# EAGLE design Blinker (EAGLE 6.3)
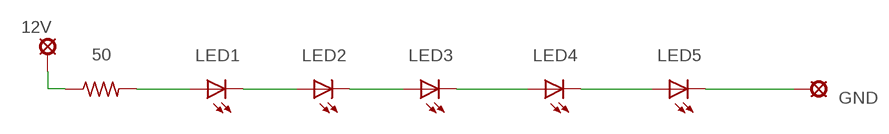
[diagram p0: schematic, sheet 1]

## Parts
12V  LSP13  [LSP13]
50  RESISTORSMD1206  [R1206]
GND  LSP13  [LSP13]
LED1  LED1  LED-2AC-CP41B-WES  [CP41B]
LED2  LED2  LED-2AC-CP41B-WES  [CP41B]
LED3  LED3  LED-2AC-CP41B-WES  [CP41B]
LED4  LED4  LED-2AC-CP41B-WES  [CP41B]
LED5  LED5  LED-2AC-CP41B-WES  [CP41B]

## Nets
GND: GND.MP LED5.1(C) LED5.4(C)
N$1: 50.2 LED1.2(A) LED1.3(A)
N$2: LED1.1(C) LED1.4(C) LED2.2(A) LED2.3(A)
N$3: LED2.1(C) LED2.4(C) LED3.2(A) LED3.3(A)
N$4: LED3.1(C) LED3.4(C) LED4.2(A) LED4.3(A)
N$5: LED4.1(C) LED4.4(C) LED5.2(A) LED5.3(A)
N$9: 12V.MP 50.1

## Library data of the parts
12V GND = solpad:LSP13: SOLDER PAD drill 1.3 mm, distributor Buerklin, 12H562
50 = SolarJackets_Common:RESISTOR
LED1-LED5 = led:LED-2AC-: LEDs with 2 Cathode & 2 Anode - Kingbright SUPER FLUX LED LAMP Source: www.us.kingbright.com/images/catalog/SPEC/W7676CPBC-H.pdf Cree® P4 LED CP41B-WES/WGS Source: Data sheet <http://www.cree.com/products/pdf/LEDlamps/CP41B-WES&WGS.pdf>

## Board
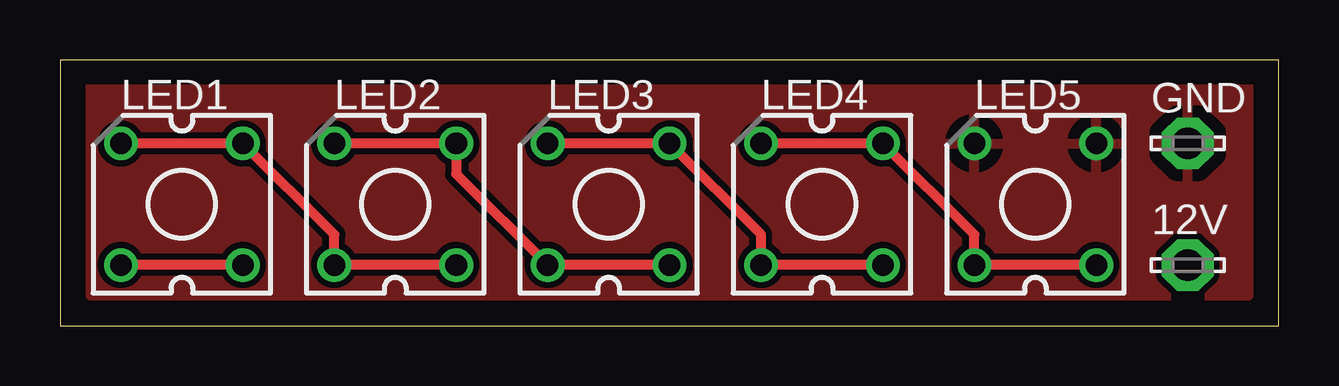
[diagram p1: board, top side]
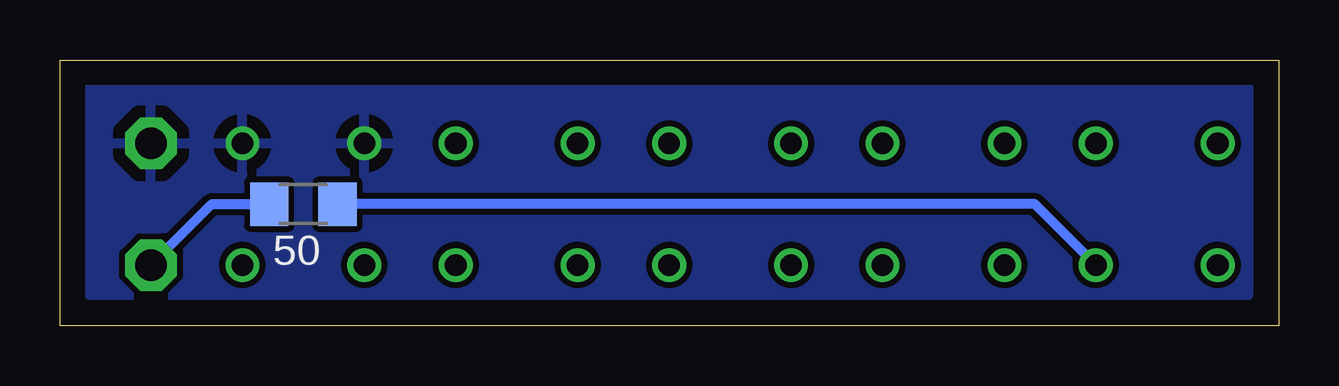
[diagram p2: board, bottom side, seen from below]

Size 50.78 x 11.1 mm. Coordinates in mm from the lower left corner, seen from the top.
Outline: 0,0 50.78,0 50.78,11.1 0,11.1 0,0
Copper layers (1*16): Top 0.035mm / dielectric 1.5mm / Bottom 0.035mm
Design rules "SJ Design Rules": minimum track width 16mil, minimum drill 24mil, track to track 10mil, track to pad 10mil, pad to pad 10mil, via to via 10mil, smd to smd 10mil, copper to edge 40mil, drill to drill 10mil, minimum pad ring 10mil, minimum via ring 8mil, stop-mask expansion 4mil, vias tented up to drill 0mil, thermal gap 20mil

### Footprints (pad centres in the part's own frame; a part is rotated, then mirrored left to right if it is on the bottom)
LSP13 = drill 1.321 pad 2.159 octagon: MP 0,0
R1206 = smd 1.6 x 1.803: 1 -1.422,0; 2 1.422,0
CP41B = drill 0.9 pad 1.27: 1 -2.54,2.54; 2 -2.54,-2.54; 3 2.54,-2.54; 4 2.54,2.54

### Placement (x,y rotation side)
12V  46.99,2.54 0 top
50  40.64,5.08 0 bottom
GND  46.99,7.62 0 top
LED1  5.08,5.08 0 top
LED2  13.97,5.08 0 top
LED3  22.86,5.08 0 top
LED4  31.75,5.08 0 top
LED5  40.64,5.08 0 top

### Tracks (layer width: path | path; a pad name or v marks a point on that pad's centre or on a via)
GND
  pour Bottom: 1.27,10.16 1.27,1.27 49.53,1.27 49.53,10.16
  pour Top: 1.27,10.16 1.27,1.27 49.53,1.27 49.53,10.16
N$1
  Top 0.406: LED1.3 LED1.2
  Bottom 0.406: 50.2 10.16,5.08 LED1.3
N$2
  Top 0.406: LED1.1 LED1.4 11.43,3.81 LED2.2 LED2.3
N$3
  Top 0.406: LED3.3 LED3.2 16.51,6.35 LED2.4 LED2.1
N$4
  Top 0.406: LED3.1 LED3.4 29.21,3.81 LED4.2 LED4.3
N$5
  Top 0.406: LED4.1 LED4.4 38.1,3.81 LED5.2 LED5.3
N$9
  Bottom 0.406: 50.1 44.45,5.08 12V.MP

### Text on the board
bValues: Blinker REV 1 / 1-12-13 | Blinker REV 1 / 1-12-13